# EAGLE design CNC_Remote (EAGLE 6.1)
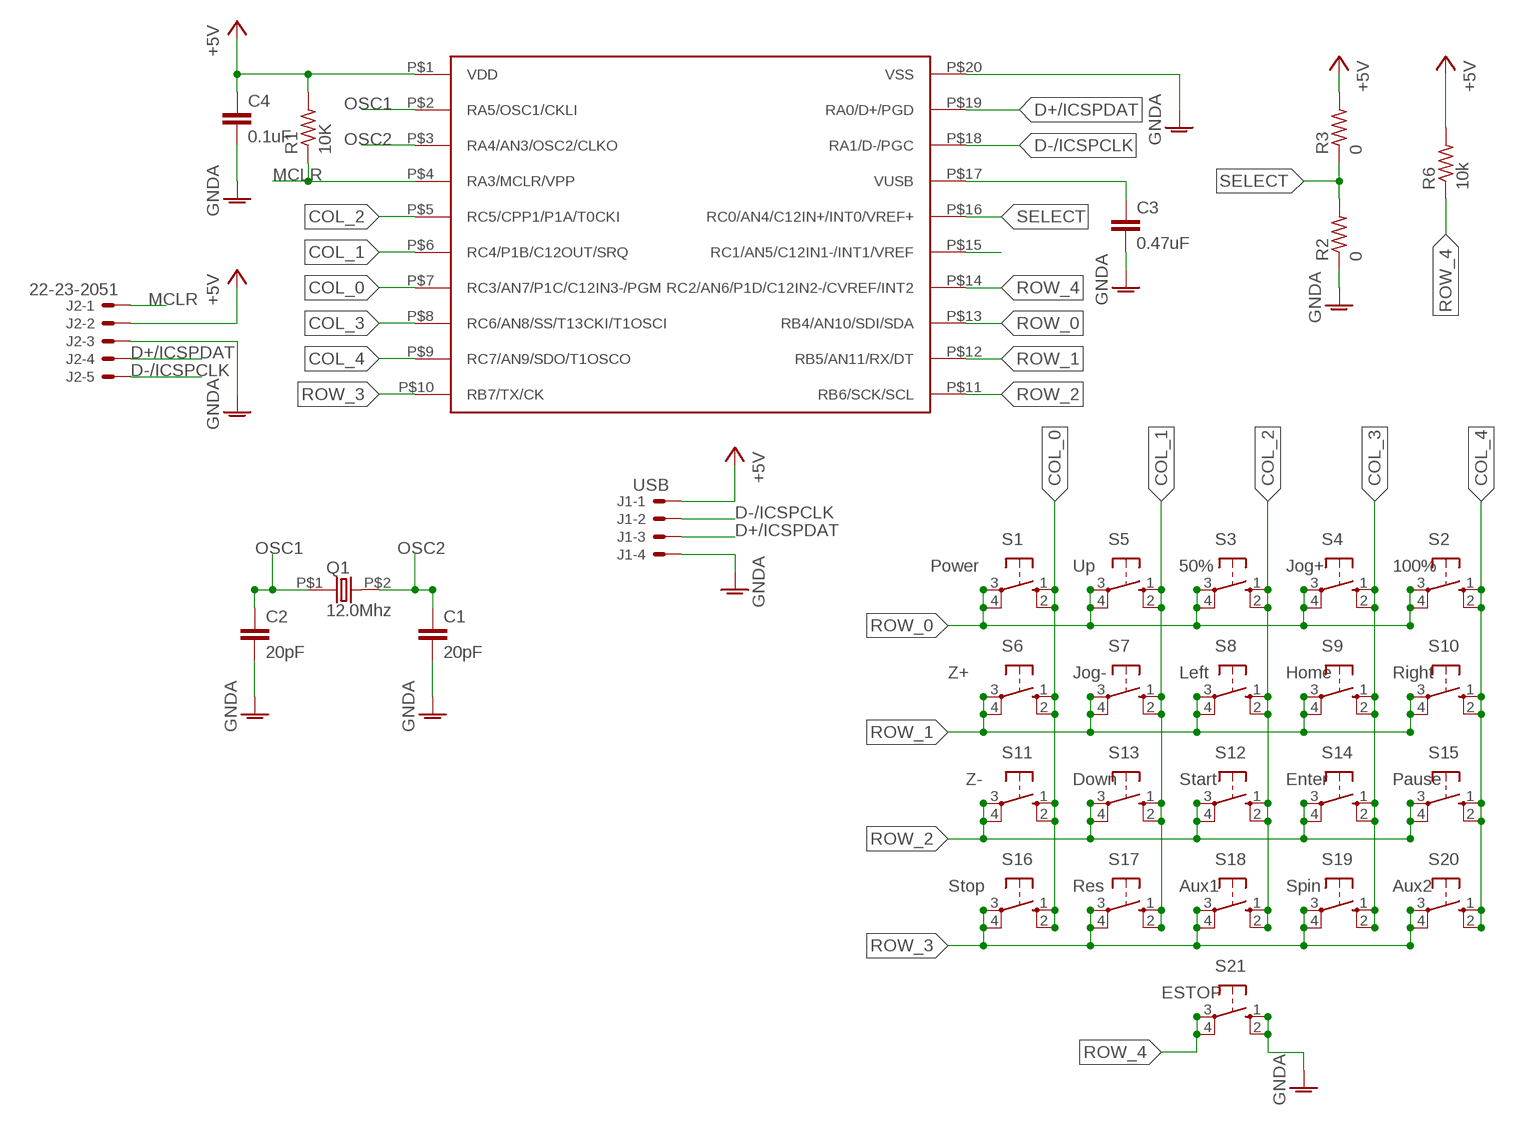
[diagram p0: schematic, sheet 1]

## Parts
C1  20pF  C-EUC0603  [C0603]
C2  20pF  C-EUC0603  [C0603]
C3  0.47uF  C-EUC0603  [C0603]
C4  0.1uF  C-EUC0603  [C0603]
J1  USB  22-23-2041  [22-23-2041]
J2  22-23-2051  [22-23-2051]
Q1  12.0Mhz  CSM-3X  [HC49/US]
R1  10K  R-US_R0603  [R0603]
R2  0  R-US_R0603  [R0603]
R3  0  R-US_R0603  [R0603]
R6  10k  R-US_R0603  [R0603]
S1  10-XX  [B3F-10XX]
S2  10-XX  [B3F-10XX]
S3  10-XX  [B3F-10XX]
S4  10-XX  [B3F-10XX]
S5  10-XX  [B3F-10XX]
S6  10-XX  [B3F-10XX]
S7  10-XX  [B3F-10XX]
S8  10-XX  [B3F-10XX]
S9  10-XX  [B3F-10XX]
S10  10-XX  [B3F-10XX]
S11  10-XX  [B3F-10XX]
S12  10-XX  [B3F-10XX]
S13  10-XX  [B3F-10XX]
S14  10-XX  [B3F-10XX]
S15  10-XX  [B3F-10XX]
S16  10-XX  [B3F-10XX]
S17  10-XX  [B3F-10XX]
S18  10-XX  [B3F-10XX]
S19  10-XX  [B3F-10XX]
S20  10-XX  [B3F-10XX]
S21  10-XX  [B3F-10XX]
U1  PIC18F1K50SOIC  [SOIC-20]

## Nets
+5V: C4.1 J1.1 J2.2 R1.2 R3.2 R6.2 U1.P$1(VDD)
COL_0: S1.1(S) S1.2(S1) S6.1(S) S6.2(S1) S11.1(S) S11.2(S1) S16.1(S) S16.2(S1) U1.P$7(RC3/AN7/P1C/C12IN3-/PGM)
COL_1: S5.1(S) S5.2(S1) S7.1(S) S7.2(S1) S13.1(S) S13.2(S1) S17.1(S) S17.2(S1) U1.P$6(RC4/P1B/C12OUT/SRQ)
COL_2: S3.1(S) S3.2(S1) S8.1(S) S8.2(S1) S12.1(S) S12.2(S1) S18.1(S) S18.2(S1) U1.P$5(RC5/CPP1/P1A/T0CKI)
COL_3: S4.1(S) S4.2(S1) S9.1(S) S9.2(S1) S14.1(S) S14.2(S1) S19.1(S) S19.2(S1) U1.P$8(RC6/AN8/SS/T13CKI/T1OSCI)
COL_4: S2.1(S) S2.2(S1) S10.1(S) S10.2(S1) S15.1(S) S15.2(S1) S20.1(S) S20.2(S1) U1.P$9(RC7/AN9/SDO/T1OSCO)
D+/ICSPDAT: J1.3 J2.4 U1.P$19(RA0/D+/PGD)
D-/ICSPCLK: J1.2 J2.5 U1.P$18(RA1/D-/PGC)
GNDA: C1.2 C2.2 C3.2 C4.2 J1.4 J2.3 R2.1 S21.1(S) S21.2(S1) U1.P$20(VSS)
MCLR: J2.1 R1.1 U1.P$4(RA3/MCLR/VPP)
N$2: C3.1 U1.P$17(VUSB)
N$4: U1.P$15(RC1/AN5/C12IN1-/INT1/VREF)
OSC1: C2.1 Q1.P$1 U1.P$2(RA5/OSC1/CKLI)
OSC2: C1.1 Q1.P$2 U1.P$3(RA4/AN3/OSC2/CLKO)
ROW_0: S1.3(P) S1.4(P1) S2.3(P) S2.4(P1) S3.3(P) S3.4(P1) S4.3(P) S4.4(P1) S5.3(P) S5.4(P1) U1.P$13(RB4/AN10/SDI/SDA)
ROW_1: S6.3(P) S6.4(P1) S7.3(P) S7.4(P1) S8.3(P) S8.4(P1) S9.3(P) S9.4(P1) S10.3(P) S10.4(P1) U1.P$12(RB5/AN11/RX/DT)
ROW_2: S11.3(P) S11.4(P1) S12.3(P) S12.4(P1) S13.3(P) S13.4(P1) S14.3(P) S14.4(P1) S15.3(P) S15.4(P1) U1.P$11(RB6/SCK/SCL)
ROW_3: S16.3(P) S16.4(P1) S17.3(P) S17.4(P1) S18.3(P) S18.4(P1) S19.3(P) S19.4(P1) S20.3(P) S20.4(P1) U1.P$10(RB7/TX/CK)
ROW_4: R6.1 S21.3(P) S21.4(P1) U1.P$14(RC2/AN6/P1D/C12IN2-/CVREF/INT2)
SELECT: R2.2 R3.1 U1.P$16(RC0/AN4/C12IN+/INT0/VREF+)

## Notes on the sheet
- Power | Up | 50% | Jog+ | 100%
- Z+ | Jog- | Left | Home | Right
- Z- | Down | Start | Enter | Pause
- Stop | Res | Aux1 | Spin | Aux2
- ESTOP

## Library data of the parts
C1-C4 = rcl:C-EU: CAPACITOR, European symbol
J1 = con-molex:22-23-2041: .100" (2.54mm) Center Header - 4 Pin; MF: MOLEX; MPN: 22-23-2041; OC_FARNELL: 1462920; OC_NEWARK: 38C0355
J2 = con-molex:22-23-2051: .100" (2.54mm) Center Header - 5 Pin; MF: MOLEX; MPN: 22-23-2051; OC_FARNELL: 1462952; OC_NEWARK: 38C9178
Q1 = crystal:CSM-3X
R1-R3 R6 = rcl:R-US_: RESISTOR, American symbol
S1-S21 = switch-omron:10-XX: OMRON SWITCH; MPN: B3F-1000; OC_FARNELL: 176432; OC_NEWARK: 36M3542
U1 = microchip:PIC18F1*K50

## Board
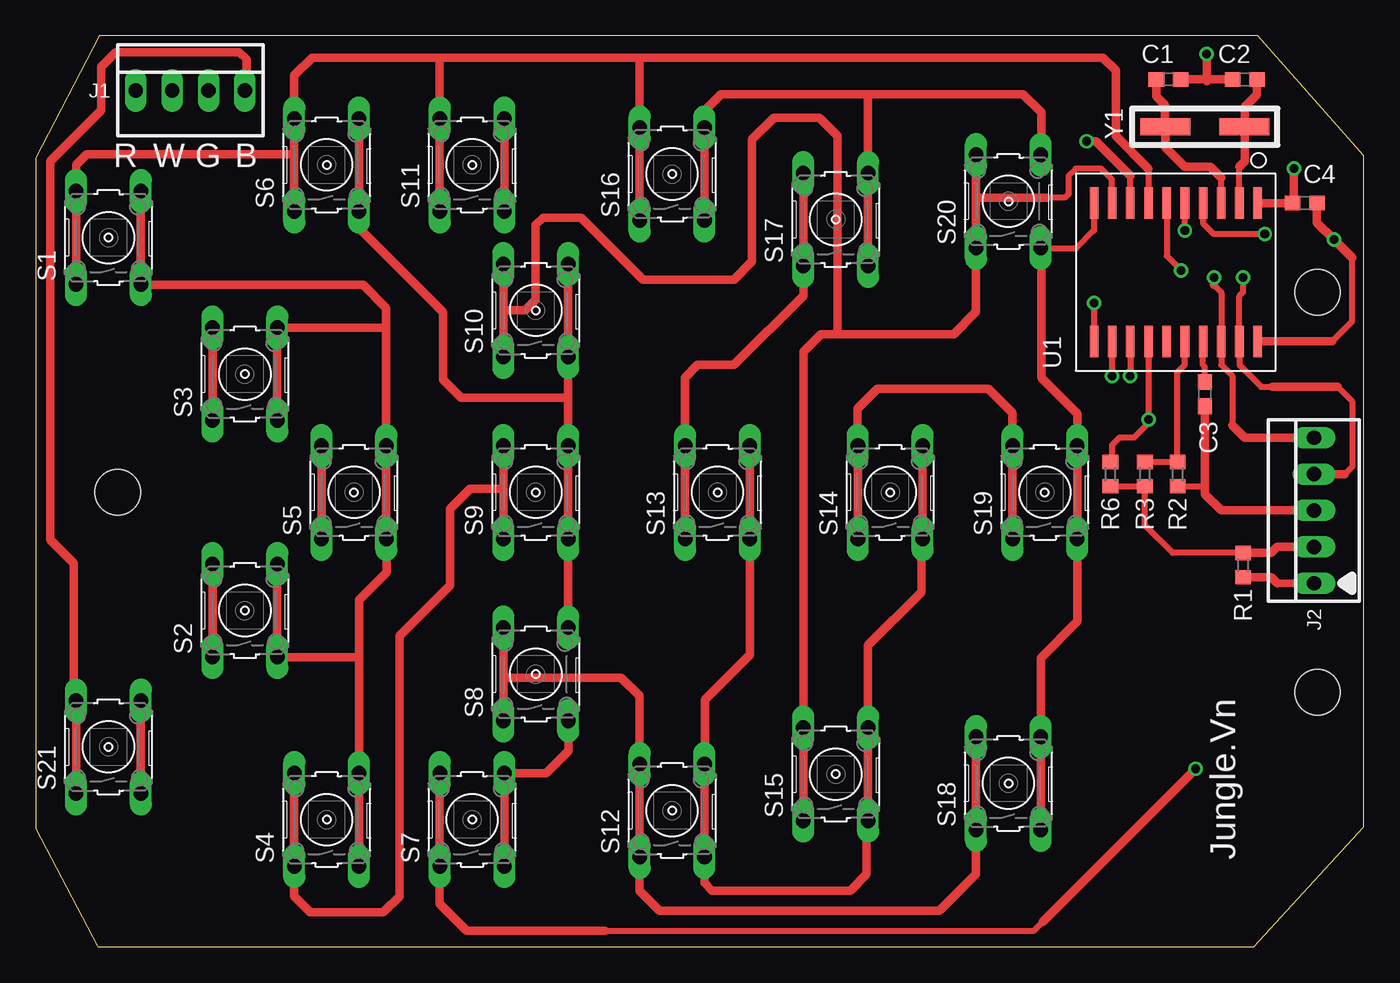
[diagram p1: board, top side]
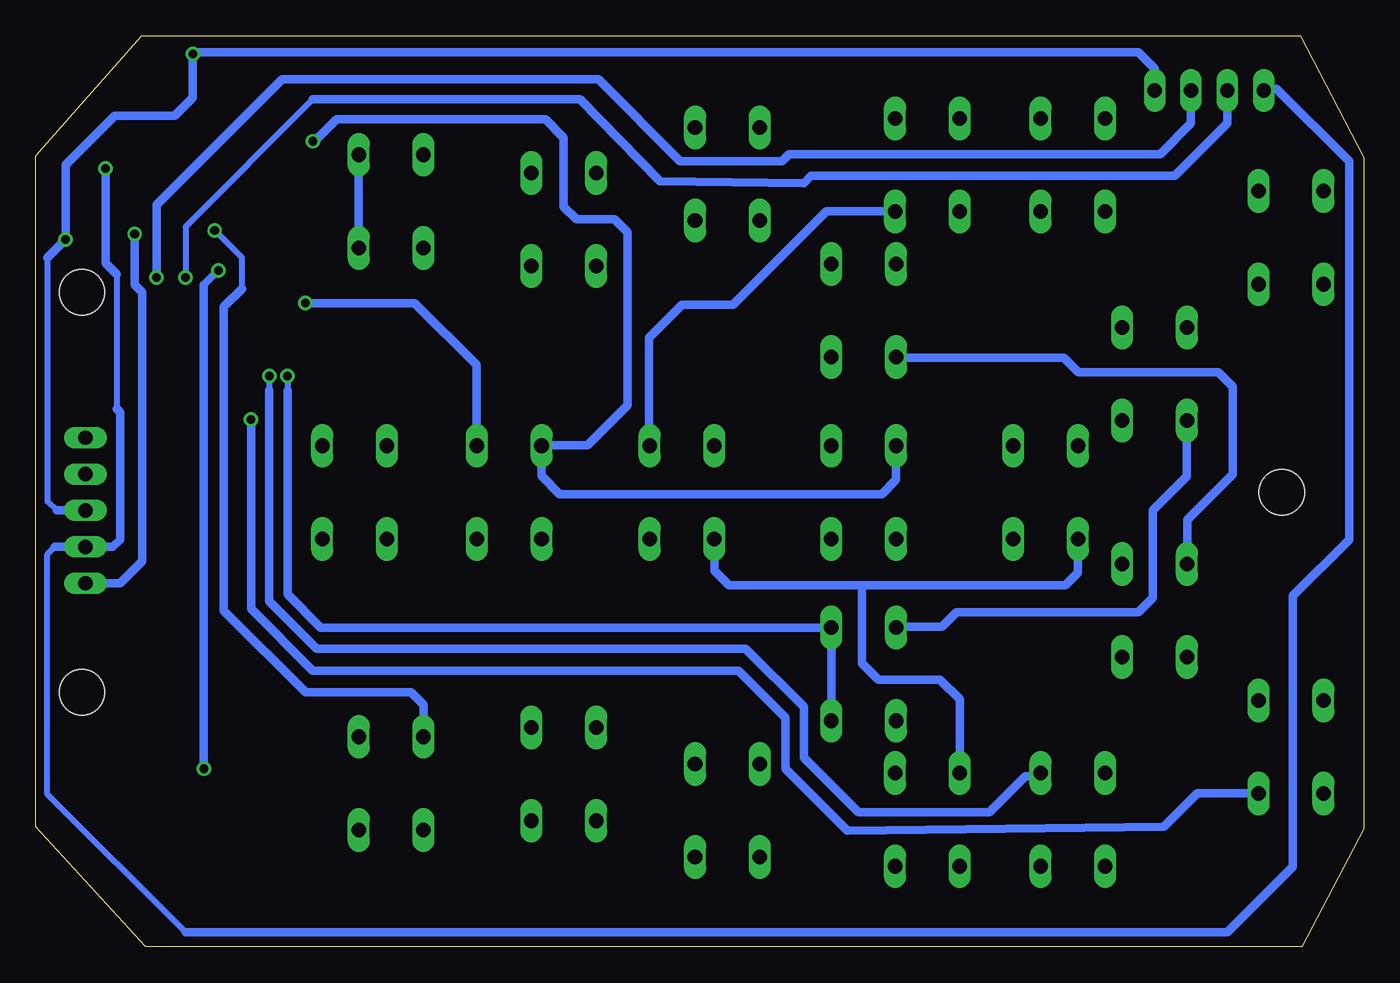
[diagram p2: board, bottom side, seen from below]

Size 92.76 x 63.63 mm. Coordinates in mm from the lower left corner, seen from the top.
Outline: 0,8.26 4.32,0 85.09,0 92.76,8.38 92.76,55.23 85.35,63.62 4.45,63.63 0,55.11 0,8.26
Copper layers (1*16): Top 0.035mm / dielectric 1.5mm / Bottom 0.035mm
Design rules "default": minimum track width 12mil, minimum drill 20mil, track to track 10mil, track to pad 10mil, pad to pad 10mil, via to via 10mil, smd to smd 8mil, copper to edge 25mil, drill to drill 10mil, minimum pad ring 10mil, minimum via ring 8mil, stop-mask expansion 4mil, vias tented up to drill 24mil, thermal gap 12mil
Holes 3.17 mm at 89.53,17.78 89.53,45.72 5.71,31.75

### Footprints (pad centres in the part's own frame; a part is rotated, then mirrored left to right if it is on the bottom)
C0603 = smd 1.1 x 1: 1 -0.85,0; 2 0.85,0
22-23-2041 = drill 1 long: 1 -3.81,0; 2 -1.27,0; 3 1.27,0; 4 3.81,0
22-23-2051 = drill 1 long: 1 -5.08,0; 2 -2.54,0; 3 0,0; 4 2.54,0; 5 5.08,0
HC49/US = smd 3.5 x 1.2: P$1 2.75,0; P$2 -2.75,0
R0603 = smd 1 x 1.1: 1 -0.85,0; 2 0.85,0
B3F-10XX = drill 1.016 long: 1 -3.251,2.261; 2 3.251,2.261; 3 -3.251,-2.261; 4 3.251,-2.261
SOIC-20 = smd 0.6 x 2.2: P$1 -11.43,0; P$2 -10.16,0; P$3 -8.89,0; P$4 -7.62,0; P$5 -6.35,0; P$6 -5.08,0; P$7 -3.81,0; P$8 -2.54,0; P$9 -1.27,0; P$10 0,0; P$11 0,9.652; P$12 -1.27,9.652; P$13 -2.54,9.652; P$14 -3.81,9.652; P$15 -5.08,9.652; P$16 -6.35,9.652; P$17 -7.62,9.652; P$18 -8.89,9.652; P$19 -10.16,9.652; P$20 -11.43,9.652

### Placement (x,y rotation side)
C1  79.12,60.58 0 top
C2  84.45,60.58 180 top
C3  81.66,38.61 270 top
C4  88.65,51.94 0 top
J1  10.79,59.82 0 top
J2  89.28,30.48 90 top
Q1  81.66,57.28 0 top
R1  84.33,26.67 90 top
R2  79.76,33.02 90 top
R3  77.47,33.02 270 top
R6  75.06,33.02 270 top
S1  5.08,49.53 90 top
S2  14.61,23.5 90 top
S3  14.61,40.01 90 top
S4  20.32,8.89 90 top
S5  22.23,31.75 90 top
S6  20.32,54.61 90 top
S7  30.48,8.89 90 top
S8  34.92,19.05 90 top
S9  34.92,31.75 90 top
S10  34.92,44.45 90 top
S11  30.48,54.61 90 top
S12  44.45,9.53 90 top
S13  47.62,31.75 90 top
S14  59.69,31.75 90 top
S15  55.88,12.06 90 top
S16  44.45,53.98 90 top
S17  55.88,50.8 90 top
S18  67.94,11.43 90 top
S19  70.48,31.75 90 top
S20  67.94,52.07 90 top
S21  5.08,13.97 90 top
U1  73.91,51.94 180 top

### Tracks (layer width: path | path; a pad name or v marks a point on that pad's centre or on a via)
+5V  (via drill 0.6)
  Top 0.406: R6.2 R3.2 77.47,29.46 79.41,27.52 R1.2
  Top 0.508: 87.88,52.07 C4.1
  Top 0.61: R1.2 86.32,27.52 86.74,27.94 J2.2 | U1.P$1 C4.1 87.88,51.94 | 87.88,51.94 87.88,51.82 | 87.88,51.94 87.88,52.07 v87.88,54.36
  Bottom 0.406: 91.44,27.94 91.95,27.43 91.95,10.67 82.3,1.02 | 87.12,46.99 87.12,37.59
  Bottom 0.61: 82.3,1.02 9.53,1.02 4.95,5.59 4.95,24.51 1.02,28.45 1.02,54.86 6.1,59.94 6.86,59.94 J1.1 | 91.44,27.94 J2.2 87.38,27.94 86.87,28.45 86.87,37.34 87.12,37.59 | v87.88,54.36 87.88,47.75 87.12,46.99
COL_0
  Top 0.406: 77.72,54.36 U1.P$7
  Top 0.508: 42.16,57.15 S16.2
  Top 0.61: S1.1 S1.2 2.82,54.63 3.56,55.37 18.06,55.37 | 18.01,57.91 S6.2 | S6.2 18.06,60.86 19.3,62.1 28.07,62.1 | S6.1 18.06,55.37 | 18.06,55.37 S6.2 | S11.1 S11.2 28.19,57.89 28.19,61.98 28.07,62.1 | S16.1 42.19,57.12 42.16,57.15 42.16,61.21 | 28.07,62.1 42.16,62.1 | 42.16,62.1 74.55,62.1 75.44,61.21 75.44,56.64 77.72,54.36 | S16.2 42.19,62.08 42.16,62.1
COL_1  (via drill 0.6)
  Top 0.406: U1.P$6 78.99,48.26 v80.01,47.24 | 39.75,1.14 69.72,1.14 70.36,1.78
  Top 0.61: S7.2 S7.1 28.22,3.02 30.1,1.14 39.75,1.14 | 70.36,1.78 v81.03,12.45 | S5.1 S5.2 | S17.2 S17.1 53.62,45.49 48.77,40.64 46.23,40.64 45.34,39.75 45.34,35.03 S13.2 S13.1
  Bottom 0.305: S13.1 45.47,28.45 45.34,28.45
  Bottom 0.508: 81.03,46.23 v80.01,47.24
  Bottom 0.61: v81.03,12.45 81.03,46.23 | S5.1 19.96,26.14 20.83,25.27 35.05,25.27 | 35.05,25.27 44.32,25.27 45.34,26.29 45.34,28.45 | S7.2 28.22,17.3 29.59,18.67 33.91,18.67 35.05,19.81 35.05,25.27
COL_2  (via drill 0.6 pad 0.41)
  Top 0.305: S18.2 65.79,14.73 65.68,14.73
  Top 0.406: v80.26,50.04 80.26,51.82
  Top 0.61: S3.1 S3.2 | 32.66,18.8 40.89,18.8 42.16,17.53 42.16,12.8 S12.2 S12.1 42.19,3.91 43.56,2.54 63.12,2.54 65.66,5.08 65.66,8.15 S18.1 S18.2 65.68,14.73 65.68,14.83 65.66,14.86 | S8.1 32.66,18.8 | 32.66,18.8 S8.2 | 80.26,52.07 U1.P$5 80.26,51.82
  Bottom 0.406: 78.36,45.97 78.36,48.13 v80.26,50.04
  Bottom 0.61: S3.1 12.34,32.87 14.73,30.48 14.73,24.38 15.75,23.37 28.45,23.37 29.46,22.35 32.61,22.35 S8.2 | S18.2 65.68,16.92 66.55,17.78 73.91,17.78 79.63,23.5 79.63,44.7 78.36,45.97
COL_3  (via drill 0.6)
  Top 0.406: U1.P$8 76.45,53.85
  Top 0.508: S4.1 18.29,5.59 18.03,5.59
  Top 0.61: S14.1 S14.2 57.4,35.03 57.4,37.59 58.8,38.99 66.55,38.99 68.22,37.31 S19.2 S19.1 | S4.2 S4.1 18.06,5.61 18.03,5.59 | 18.03,5.59 18.03,5.71 | 18.03,5.59 18.03,3.56 19.18,2.41 24.26,2.41 25.4,3.56 25.4,21.72 28.96,25.27 28.96,30.61 30.35,32 32.51,32 | S9.2 32.66,32 32.51,32 | S9.1 32.66,31.85 32.51,32 | 76.45,53.85 74.04,56.26 v73.41,56.26
  Bottom 0.61: v73.41,56.26 73.28,56.26 71.75,57.78 57.15,57.78 55.88,56.52 55.88,51.69 54.99,50.8 52.32,50.8 51.44,49.91 51.44,37.85 54.23,35.05 57.38,35.05 S14.2 57.43,32.89 56.16,31.62 33.66,31.62 32.66,32.61 S9.2
COL_4
  Top 0.406: 75.18,52.07 75.18,53.59 74.42,54.36 72.64,54.36 72.14,53.85 72.14,52.58 71.88,52.32 70.61,52.32
  Top 0.61: S15.1 S15.2 53.62,41.55 54.86,42.8 55.88,42.8 | 65.68,52.32 S20.1 65.68,44.35 64.14,42.8 55.88,42.8 | 65.68,52.32 S20.2 | S10.1 32.66,44.32 | 32.66,44.32 S10.2 | 32.66,44.32 32.79,44.45 34.16,44.45 34.92,45.21 34.92,50.42 35.43,50.93 38.1,50.93 42.42,46.61 48.77,46.61 50.04,47.88 50.04,56.39 51.56,57.91 54.74,57.91 56.01,56.64 56.01,42.93 55.88,42.8 | 65.68,52.32 70.61,52.32 | U1.P$9 75.18,52.07 | S2.1 S2.2
  Bottom 0.61: S10.1 32.61,41.15 20.95,41.15 19.94,40.13 10.16,40.13 9.14,39.12 9.14,33.02 12.32,29.84 12.32,26.77 S2.2
D+/ICSPDAT  (via drill 0.6)
  Top 0.406: 90.93,39.12 91.95,38.1 91.95,33.53 91.44,33.02 | v84.33,46.74 84.33,45.72 84.07,45.47 U1.P$19 84.07,40.64 85.6,39.12 86.36,39.12
  Top 0.61: 86.36,39.12 90.93,39.12 | 91.44,33.02 J2.4
  Bottom 0.61: J1.3 12.06,57.53 14.22,55.37 40.13,55.37 40.64,54.86 47.75,54.86 53.47,60.58 75.56,60.58 84.33,51.82 v84.33,46.74
D-/ICSPCLK  (via drill 0.6)
  Top 0.305: 83.57,36.32 83.63,36.39
  Top 0.406: 82.3,46.23 82.8,45.72 U1.P$18 82.8,40.64 83.57,39.88 83.57,36.32
  Top 0.61: 83.57,36.45 83.63,36.39 84.45,35.56 J2.5 | v82.3,46.74 82.3,46.23
  Bottom 0.406: 73.41,59.18 82.3,50.29 v82.3,46.74
  Bottom 0.61: J1.2 9.53,57.53 13.21,53.85 38.61,53.85 39.12,53.34 49.15,53.47 54.74,59.18 73.41,59.18
GNDA  (via drill 0.6)
  Top 0.406: 91.95,48.13 91.95,43.69 90.55,42.29 | R2.1 81.5,32.17 81.66,32
  Top 0.508: C1.2 80.01,60.71 80.01,60.58 | C2.2 83.57,60.71 83.57,60.58
  Top 0.61: S21.1 S21.2 2.67,17.37 2.67,26.8 1.02,28.45 1.02,54.86 4.57,58.42 4.57,61.47 5.59,62.48 14.22,62.48 14.73,61.98 14.73,59.94 J1.4 | v81.79,62.36 81.79,60.58 | 81.79,60.58 81.79,60.45 | 80.01,60.45 80.01,60.58 81.79,60.58 | 83.57,60.58 81.79,60.58 | C4.2 89.5,50.59 v90.68,49.4 91.95,48.13 | C3.2 81.66,32 81.66,31.62 82.8,30.48 J2.3 89.41,30.48 | U1.P$20 90.55,42.29
  Bottom 0.406: 91.95,48.13 91.95,31.11 91.31,30.48
  Bottom 0.61: 91.31,30.48 J2.3 | 91.95,48.13 v90.68,49.4 90.68,54.61 87.25,58.04 83.06,58.04 81.79,59.31 v81.79,62.36 81.66,62.48 15.75,62.48 14.61,61.34 J1.4
MCLR  (via drill 0.6)
  Top 0.406: v85.85,49.78 82.3,49.78 81.53,50.55 U1.P$4
  Top 0.508: J2.1 86.74,25.4
  Top 0.61: R1.1 86.32,25.82 86.74,25.4
  Bottom 0.61: J2.1 86.87,25.4 85.34,26.92 85.34,45.72 85.85,46.23 v85.85,49.78
N$2
  Top 0.406: C3.1 81.66,40.51 81.53,40.64 U1.P$17 81.53,42.42
OSC1
  Top 0.406: U1.P$2 84.07,54.48
  Top 0.61: C2.1 85.31,59.52 84.45,58.67 84.45,57.32 Q1.P$1 84.45,57.23 84.45,54.86 84.07,54.48
OSC2
  Top 0.406: U1.P$3 82.8,53.72
  Top 0.61: C1.1 78.27,59.4 78.87,58.8 78.87,57.28 Q1.P$2 78.91,55.84 80.26,54.48 82.04,54.48 82.8,53.72
ROW_0  (via drill 0.6 pad 0.41)
  Top 0.305: S5.3 24.64,28.45 24.51,28.45
  Top 0.406: U1.P$13 v76.45,39.88
  Top 0.61: 22.58,20.07 S4.4 S4.3 | 22.58,20.07 22.58,24.23 24.51,26.16 24.51,28.45 24.51,28.47 | 24.49,43.18 24.49,44.6 22.86,46.23 7.39,46.23 S1.3 S1.4 | S3.3 S3.4 24.41,43.26 24.49,43.18 | 22.58,20.07 22.4,20.24 S2.3 S2.4 | S5.3 S5.4 24.49,43.18
  Bottom 0.305: 22.61,12.19 S4.4
  Bottom 0.406: v76.45,39.88 76.45,38.86
  Bottom 0.61: 76.45,38.86 76.45,24.13 73.15,20.83 43.18,20.83 39.12,16.76 39.12,13.21 35.31,9.4 26.16,9.4 23.62,11.94 23.11,11.94 22.61,12.45 22.61,12.19
ROW_1  (via drill 0.6 pad 0.41)
  Top 0.406: U1.P$12 v75.18,39.88
  Top 0.61: S7.3 S7.4 35.64,12.14 37.21,13.72 37.21,15.77 S8.3 | S8.4 S9.3 S9.4 37.19,38.23 | 37.19,38.23 S10.3 S10.4 | S6.4 S6.3 22.58,50.19 28.45,44.32 28.45,39.62 29.72,38.35 37.06,38.35 37.19,38.23
  Bottom 0.406: v75.18,39.88 75.18,38.86
  Bottom 0.61: 75.18,38.86 75.18,24.64 72.85,22.3 S8.4 S8.3
ROW_2  (via drill 0.6 pad 0.41)
  Top 0.406: v73.91,44.96 U1.P$11
  Top 0.61: 61.98,28.47 S14.3 | S14.3 S14.4 | S11.4 S11.3 | S13.4 S13.3 49.89,20.42 46.74,17.27 46.74,12.8 S12.4 S12.3 46.71,4.47 47.24,3.94 56.9,3.94 58.04,5.08 58.04,8.71 S15.3 S15.4 58.14,21.06 61.85,24.77 61.85,28.4 S14.3
  Bottom 0.305: 49.91,35.05 50.04,35.05 S13.4
  Bottom 0.508: 61.98,35.05 S14.4
  Bottom 0.61: S11.3 37.54,51.36 44.07,44.83 47.62,44.83 49.91,42.55 49.91,35.05 49.91,35.03 | 61.98,35.05 61.98,40.64 66.29,44.96 v73.91,44.96
ROW_3
  Top 0.406: U1.P$10 73.91,50.04 72.64,48.77 70.26,48.77 S20.3 70.21,48.87 70.23,48.9
  Top 0.61: S18.3 S18.4 70.21,20.17 72.77,22.73 72.77,28.47 S19.3 S19.4 72.75,37.24 70.23,39.75 70.23,48.9 | S16.3 S16.4 46.71,58.4 47.88,59.56 58.04,59.56 | 58.04,59.56 68.96,59.56 70.23,58.29 70.23,55.35 S20.4 | S17.3 S17.4 58.14,59.46 58.04,59.56
  Bottom 0.61: S20.4 S20.3
ROW_4  (via drill 0.6 pad 0.41)
  Top 0.305: R6.1 75.18,34.04 75.06,34.16
  Top 0.406: U1.P$14 v77.72,36.83 77.72,36.58 76.71,35.56 75.69,35.56 75.18,35.05 75.18,34.29 75.06,34.16 74.93,34.04 74.93,33.78
  Top 0.61: S21.4 S21.3
  Bottom 0.61: S21.3 11.63,10.72 13.97,8.38 36.07,8.13 40.39,12.45 40.39,16 43.69,19.3 73.41,19.3 77.72,23.62 v77.72,36.83
SELECT
  Top 0.305: 79.76,33.78 R2.2
  Top 0.406: R3.1 79.67,33.87 79.76,33.78 | R2.2 79.76,40.13 80.26,40.64 U1.P$16

### Text on the board
tPlace: R | W | G | B | Y1 | U1
tNames: Jungle.Vn